# EAGLE design ac-dc.brd_2014-10-22 (EAGLE 6.6.0)
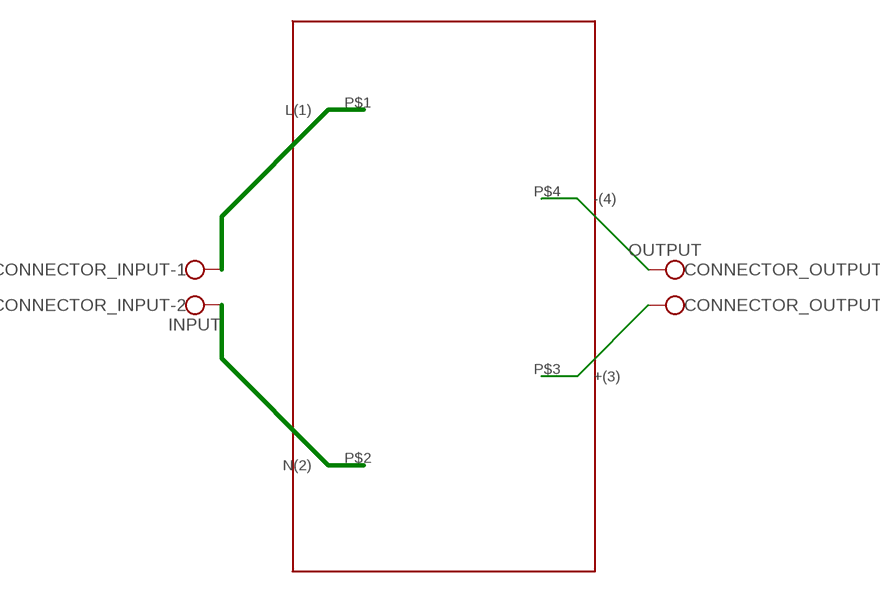
[diagram p0: schematic, sheet 1]

## Parts
CONNECTOR_INPUT  INPUT  W237-102  [W237-102]
CONNECTOR_OUTPUT  OUTPUT  W237-102  [W237-102]
U$2  VTX_214  [VTX-214-005]

## Nets
N$1: CONNECTOR_OUTPUT.2 U$2.P$4(-(4))
N$2: CONNECTOR_OUTPUT.1 U$2.P$3(+(3))
N$3: CONNECTOR_INPUT.2 U$2.P$2(N(2))
N$4: CONNECTOR_INPUT.1 U$2.P$1(L(1))

## Library data of the parts
CONNECTOR_INPUT = con-wago-500:W237-102: WAGO SCREW CLAMP; MF: INPUT; MPN: 237-102; OC_FARNELL: unknown; OC_NEWARK: 70K9898
CONNECTOR_OUTPUT = con-wago-500:W237-102: WAGO SCREW CLAMP; MPN: 237-102; OC_FARNELL: unknown; OC_NEWARK: 70K9898
U$2 = VTX-214:VTX_214

## Board
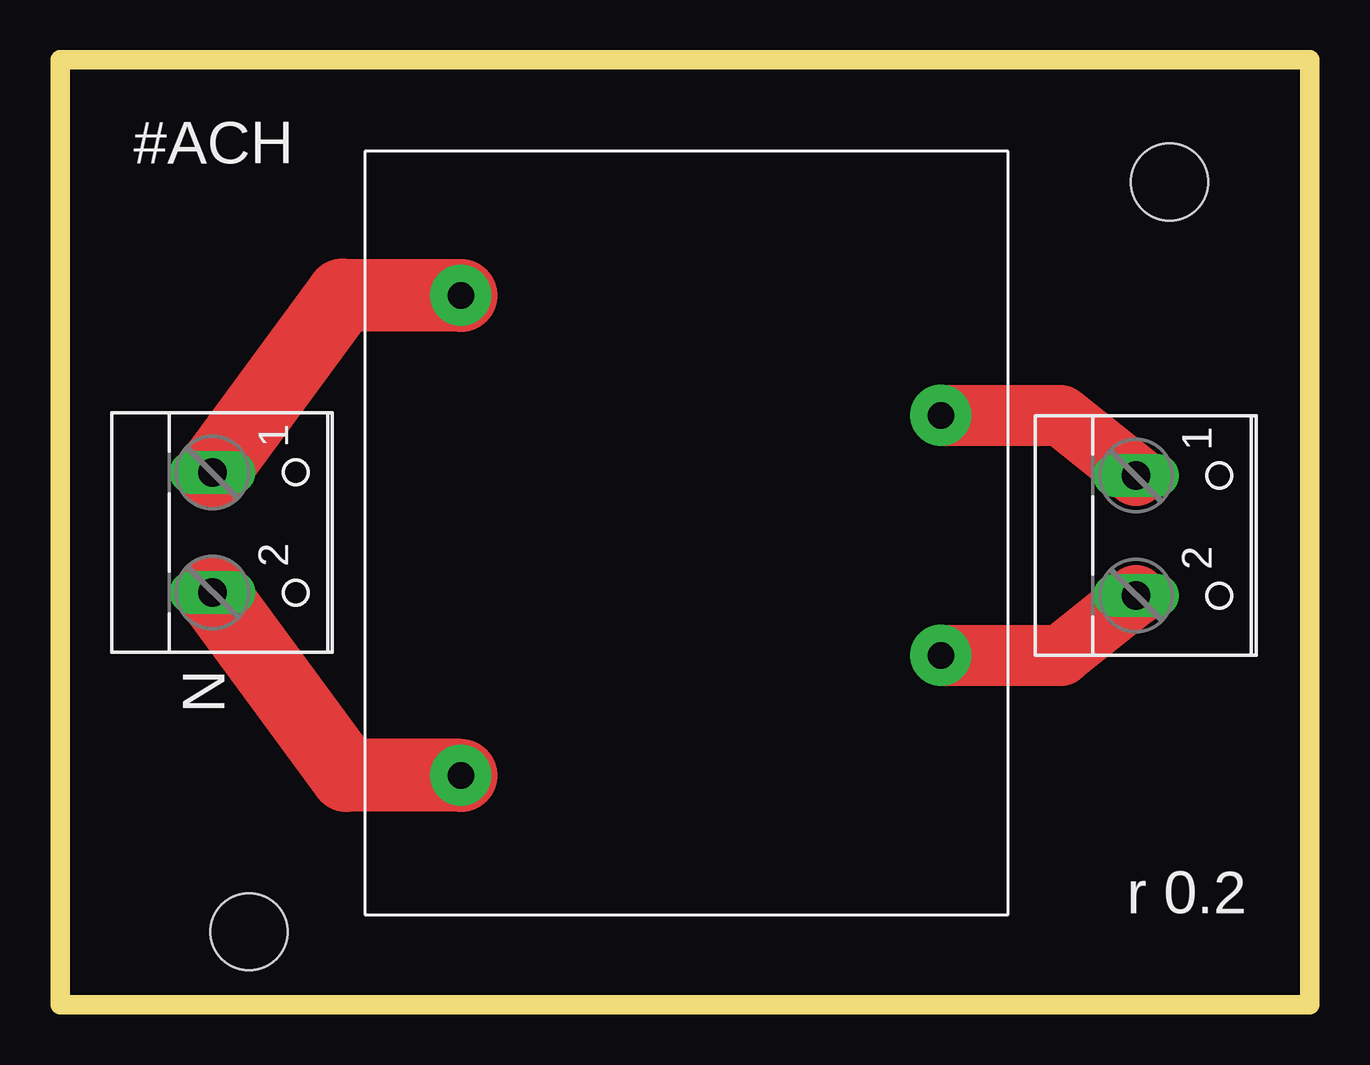
[diagram p1: board, top side]

Size 52.07 x 39.37 mm. Coordinates in mm from the lower left corner, seen from the top.
Outline: 0,0 0,39.37 52.07,39.37 52.07,0 0,0
Copper layers (1*16): Top 0.035mm / dielectric 1.5mm / Bottom 0.035mm
Design rules "default": minimum track width 10mil, minimum drill 24mil, track to track 8mil, track to pad 8mil, pad to pad 8mil, via to via 8mil, smd to smd 8mil, copper to edge 40mil, drill to drill 8mil, minimum pad ring 10mil, minimum via ring 8mil, stop-mask expansion 4mil, vias tented up to drill 0mil, thermal gap 10mil
Holes 3.2 mm at 7.87,3.05 46.23,34.29

### Footprints (pad centres in the part's own frame; a part is rotated, then mirrored left to right if it is on the bottom)
W237-102 = drill 1.194 long: 1 -2.5,-1.27; 2 2.5,-1.27
VTX-214-005 = drill 1.1 pad 2.54: P$1 6,4; P$2 26,4; P$3 11,24; P$4 21,24

### Placement (x,y rotation side)
CONNECTOR_INPUT  7.62,19.69 270 top
CONNECTOR_OUTPUT  46.1,19.56 270 top
U$2  12.7,35.56 270 top

### Tracks (layer width: path | path; a pad name or v marks a point on that pad's centre or on a via)
N$1
  Top 2.54: U$2.P$4 41.7,14.56 CONNECTOR_OUTPUT.2
N$2
  Top 2.54: U$2.P$3 41.69,24.56 CONNECTOR_OUTPUT.1
N$3
  Top 3.048: U$2.P$2 11.94,9.56 CONNECTOR_INPUT.2
N$4
  Top 3.048: U$2.P$1 11.78,29.58 CONNECTOR_INPUT.1

### Text on the board
tPlace: #ACH | r 0.2
tNames: N
bNames: L | - | +